# Altium schematic sheet 02_ESP8266.SchDoc
size A4
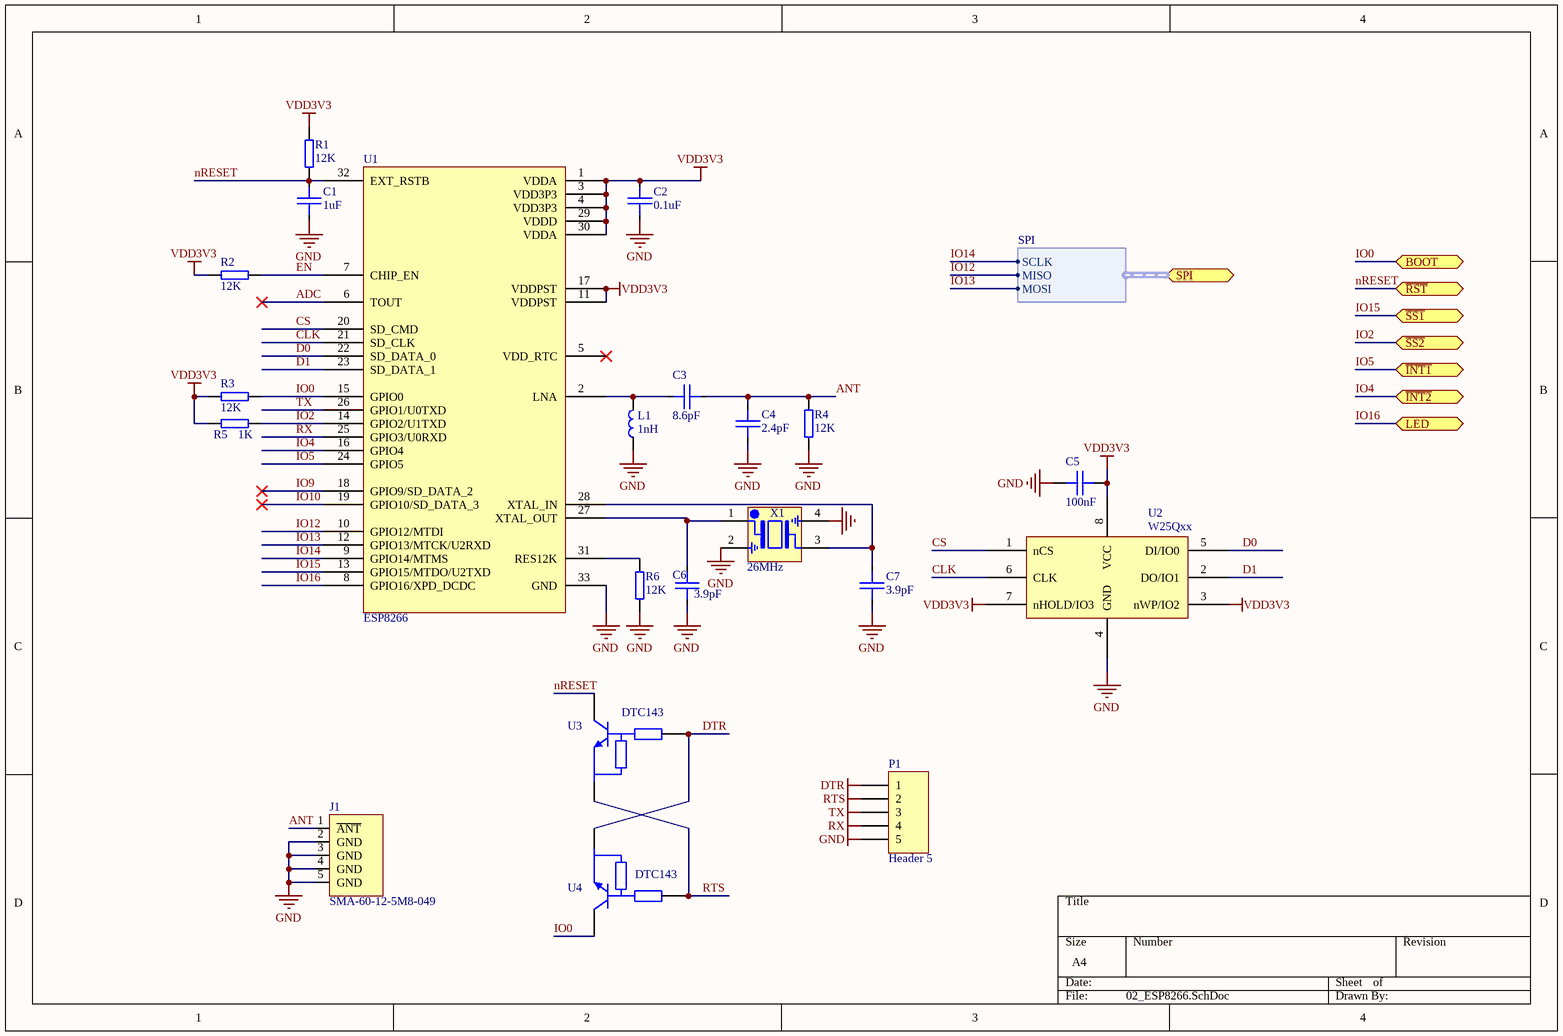
[diagram p0: 02_ESP8266.SchDoc]

## Parts
C1  1uF  [SMT_C_0402]
C2  0.1uF  [SMT_C_0402]
C3  8.6pF  [SMT_C_0402]
C4  2.4pF  [SMT_C_0402]
C5  100nF  [SMT_C_0402]
C6  3.9pF  [SMT_C_0402]
C7  3.9pF  [SMT_C_0402]
J1  SMA-60-12-5M8-049  [SMA-60-12-5M8-049]
L1  1nH  [SMT_L_0402]
P1  Header 5  [HDR1X5]
R1  12K  [SMT_R_0402]
R2  12K  [SMT_R_0402]
R3  12K  [SMT_R_0402]
R4  12K  [SMT_R_0402]
R5  1K  [SMT_R_0402]
R6  12K  [SMT_R_0402]
U1  ESP8266  [QFN32]
U2  W25Qxx  [SOP-8]
U3  DTC143  [SOT23-3]
U4  DTC143  [SOT23-3]
X1  26MHz  [SMT_XTAL_3225]

## Ports
BOOT, LED, SPI (harness SPI), ~{INT1}, ~{INT2}, ~{RST}, ~{SS1}, ~{SS2}

## Harnesses
SPI: MISO, MOSI, SCLK

## Nets
DTR: P1.1 U3.1(B) U4.2(E)
GND: C1.2 C2.2 C4.2 C5.2 C6.2 C7.2 J1.2(GND) J1.3(GND) J1.4(GND) J1.5(GND) L1.2 P1.5 R4.1 R6.2 U1.33(GND) U2.4(GND) X1.2(GND) X1.4(GND)
RTS: P1.2 U3.2(E) U4.1(B)
RX: P1.4 U1.25(GPIO3/U0RXD)
TX: P1.3 U1.26(GPIO1/U0TXD)
VDD3V3: C2.1 C5.1 R1.2 R2.2 R3.2 R5.2 U1.1(VDDA) U1.3(VDD3P3) U1.4(VDD3P3) U1.11(VDDPST) U1.17(VDDPST) U1.29(VDDD) U1.30(VDDA) U2.3(nWP/IO2) U2.7(nHOLD/IO3) U2.8(VCC)
ADC: U1.6(TOUT)
ANT: C3.1 C4.1 J1.1(~{ANT}) R4.2
CLK: U1.21(SD_CLK) U2.6(CLK)
CS: U1.20(SD_CMD) U2.1(nCS)
D0: U1.22(SD_DATA_0) U2.5(DI/IO0)
D1: U1.23(SD_DATA_1) U2.2(DO/IO1)
EN: R2.1 U1.7(CHIP_EN)
IO0: R3.1 U1.15(GPIO0) U4.3(C) ; port BOOT
IO2: R5.1 U1.14(GPIO2/U1TXD) ; port ~{SS2}
IO4: U1.16(GPIO4) ; port ~{INT2}
IO5: U1.24(GPIO5) ; port ~{INT1}
IO9: U1.18(GPIO9/SD_DATA_2)
IO10: U1.19(GPIO10/SD_DATA_3)
IO12: U1.10(GPIO12/MTDI) ; port SPI.MISO
IO13: U1.12(GPIO13/MTCK/U2RXD) ; port SPI.MOSI
IO14: U1.9(GPIO14/MTMS) ; port SPI.SCLK
IO15: U1.13(GPIO15/MTDO/U2TXD) ; port ~{SS1}
IO16: U1.8(GPIO16/XPD_DCDC) ; port LED
nRESET: C1.1 R1.1 U1.32(EXT_RSTB) U3.3(C) ; port ~{RST}
NetC3_2: C3.2 L1.1 U1.2(LNA)
NetC6_1: C6.1 U1.27(XTAL_OUT) X1.1(IN/OUT)
NetC7_1: C7.1 U1.28(XTAL_IN) X1.3(IN/OUT)
NetR6_1: R6.1 U1.31(RES12K)

Not connected (* = marked no-connect by the designer): U1 5(VDD_RTC)*

## Library data of the parts
C1-C4 C6 C7 = SMT_C_0402_1: Surface mount capacitor 0402
C5 = SMT_C_0402: Surface mount capacitor 0402
J1 = SMA-60-12-5M8-049: sma 60-12-5M8-049
L1 = SMT_L_0402: Surface mount inductor 0402
P1 = Header 5: Header, 5-Pin; LatestRevisionDate: 17-Jul-2002; LatestRevisionNote: Re-released for DXP Platform.; Publisher: Altium Limited
R1-R6 = SMT_R_0402: Surface mount resistor 0402
U2 = W25Qxx: Serial flash memory with dual and quad SPI
U3 U4 = DTC143: Digital transistors (built-in resistors)
X1 = SMT_XTAL_PASSIVE: Passive crystal